# Altium schematic sheet sche_ds18b20.SchDoc
size A3
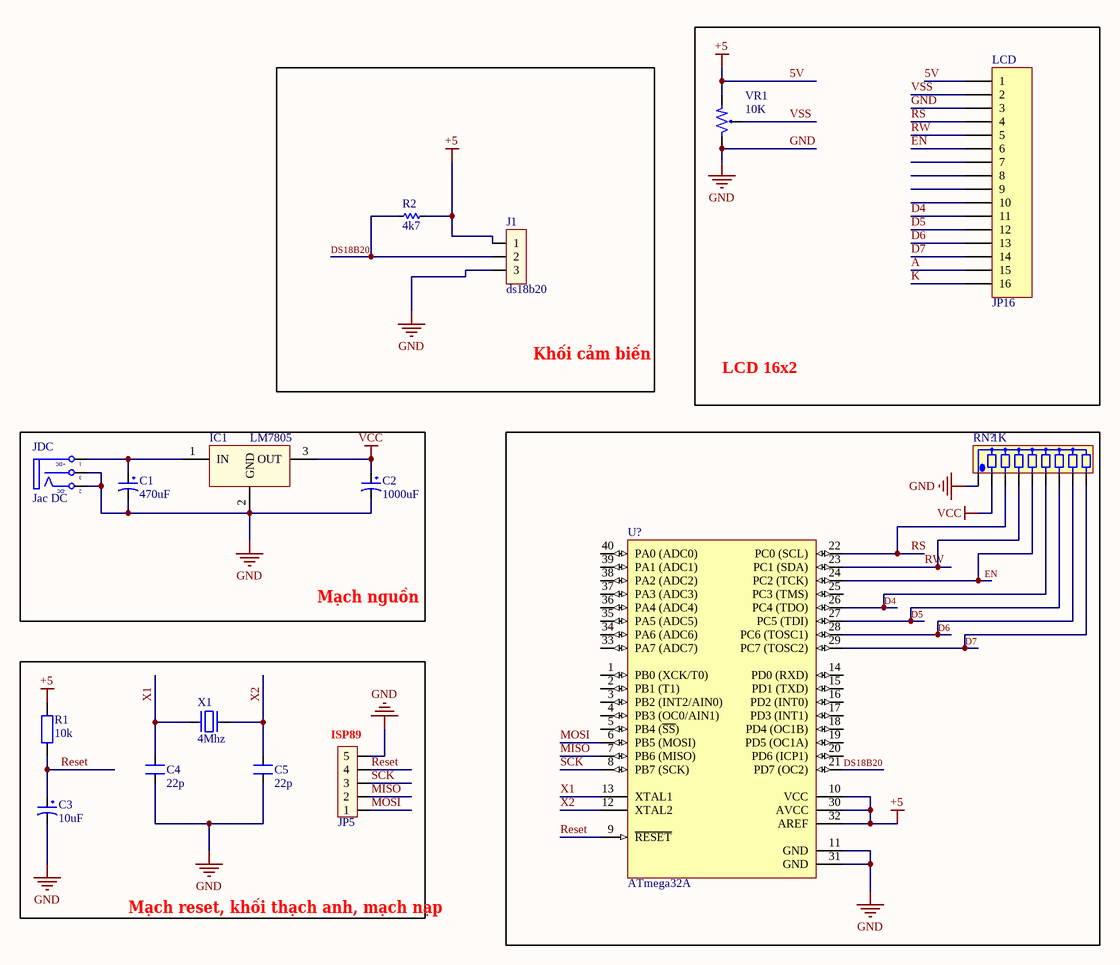
[diagram p0: sche_ds18b20.SchDoc]

## Parts
?  JP5  [JP5]
C1  470uF  [CP1/2]
C2  1000uF  [CP1/2]
C3  10uF  [CP1/2]
C4  22p  [CN1]
C5  22p  [CN1]
IC1  LM7805  [QTO-220]
J1  ds18b20  [JP3]
JDC  Jac DC  [DC-IN]
LCD  JP16  [JP16-C1T]
R1  10k  [R1/4W]
R2  4k7  [RES-SMD-0201]
RN?  1K  [RN8]
U?  ATmega32A  [DIP40/W0.6]
VR1  10K  [VR]
X1  4Mhz  [XT2]

## Blocks framed on the sheet
LCD 16x2: LCD VR1
Khối cảm biến: J1 R2
Mạch nguồn: C1 C2 IC1 JDC
Mạch reset, khối thạch anh, mạch nạp: ? C3-C5 R1 X1

## Nets
5V: J1.1 LCD.1 R1.2 R2.1 U?.10(VCC) U?.30(AVCC) U?.32(AREF) VR1.1  [also labelled +5]
GND: ?.5 C1.2 C2.2 C3.2 C4.2 C5.1 IC1.2(GND) J1.3 JDC.2(TN) JDC.3(S) LCD.3 RN?.1 U?.11(GND) U?.31(GND) VR1.3
VCC: C2.1 IC1.3(OUT) RN?.2
A: LCD.15
D4: LCD.11 RN?.6 U?.26(PC4_(TDO))
D5: LCD.12 RN?.7 U?.27(PC5_(TDI))
D6: LCD.13 RN?.8 U?.28(PC6_(TOSC1))
D7: LCD.14 RN?.9 U?.29(PC7_(TOSC2))
DS18B20: J1.2 R2.2 U?.21(PD7_(OC2))
EN: LCD.6 RN?.5 U?.24(PC2_(TCK))
K: LCD.16
MISO: ?.2 U?.7(PB6_(MISO))
MOSI: ?.1 U?.6(PB5_(MOSI))
Reset: ?.4 C3.1 R1.1 U?.9(~{RESET})
RS: LCD.4 RN?.3 U?.22(PC0_(SCL))
RW: LCD.5 RN?.4 U?.23(PC1_(SDA))
SCK: ?.3 U?.8(PB7_(SCK))
VSS: LCD.2 VR1.2
X1: C4.1 U?.13(XTAL1) X1.2
X2: C5.2 U?.12(XTAL2) X1.1
NetC1_1: C1.1 IC1.1(IN) JDC.1(T)

Not connected (* = marked no-connect by the designer): LCD 7 8 9 10; U? 1(PB0_(XCK/T0)) 2(PB1_(T1)) 3(PB2_(INT2/AIN0)) 4(PB3_(OC0/AIN1)) 5(PB4_(~{SS})) 14(PD0_(RXD)) 15(PD1_(TXD)) 16(PD2_(INT0)) 17(PD3_(INT1)) 18(PD4_(OC1B)) 19(PD5_(OC1A)) 20(PD6_(ICP1)) 25(PC3_(TMS)) 33(PA7_(ADC7)) 34(PA6_(ADC6)) 35(PA5_(ADC5)) 36(PA4_(ADC4)) 37(PA3_(ADC3)) 38(PA2_(ADC2)) 39(PA1_(ADC1)) 40(PA0_(ADC0))

## Notes on the sheet
- ISP89
- (in symbol DCIN) +DC; -DC

## Library data of the parts
C1-C3 = CP1: Cap P  0,1uF < 22uF , 16 - 50V; Value: 10uF/50V; Description 1: 10 => 220uF/6,3V/10V - 10uF => 100uF/16V; Description 2: 0,1uF => 33uF/50V - 10uF => 22uF/63V; Description 3: 0,47uF => 10uF/100V
C4 C5 = CN1: Cap np  1pF - 472pF; Value: 100pF
IC1 = LM78xx: On ap +, from + 5 to + 24VDC; Value: LM7805
J1 = JP3: Jumper 3; Value: J3
JDC = DCIN: Jac DC input; Value: Jac DC
LCD = JP16: WR-PHD 2.54 mm Angled Socket Header; Manufacturer: W¨¹rth Elektronik eiSos GmbH; partNo: 613016143121; ComponentLink1 Description: Manufacturer; ComponentLink2 Description: Datasheet; NoPins: 16; Created Date: 29 March 2013; ComponentLink1URL: http://www.we-online.com; ComponentLink2URL: http://katalog.we-online.de/em/datasheet/6130xx143121.pdf; Created by: Karrer Zheng
R1 = R1/4W: Resistor 1/4W; Value: R1/4W - 1K
R2 = Res-SMD: Resistor; Manufacturer: Generic Components; Class: Passive; Published: 08/06/2000; Publisher: Altium Hobart Technology Centre
RN? = RN8: Resistor 8 (Thanh); Value: Tro thanh 10K
U? = ATmega32A-PU: 8-Bit AVR Microcontroller with 32K Bytes of In-System Programmable Flash Memory; Published: 17-Sep-2003; DatasheetVersion: 2503C-AVR-10/02; PackageVersion: revB, Sep-2001; PackageReference: 40P6; Publisher: Altium Limited; PackageDescription: 40-lead (0.600"/15.24mm Wide) Plastic Dual Inline Package (PDIP); Supplier 1: Digi-Key; Supplier Part Number 1: ATMEGA32-16PC-ND; Supplier 2: Mouser; Supplier Part Number 2: 556-ATMEGA32-16PC; Code_JEDEC: MS-011-AC; ComponentLink1Description: Datasheet; ComponentLink1URL: http://www.atmel.com/dyn/resources/prod_documents/doc2503.pdf; ComponentLink2Description: Atmel.com Home; ComponentLink2URL: http://www.atmel.com
VR1 = VR1: Var Resistor; Value: VR 10K
X1 = XT2: Crystal For all Crystal 2pin.; Value: 4Mhz